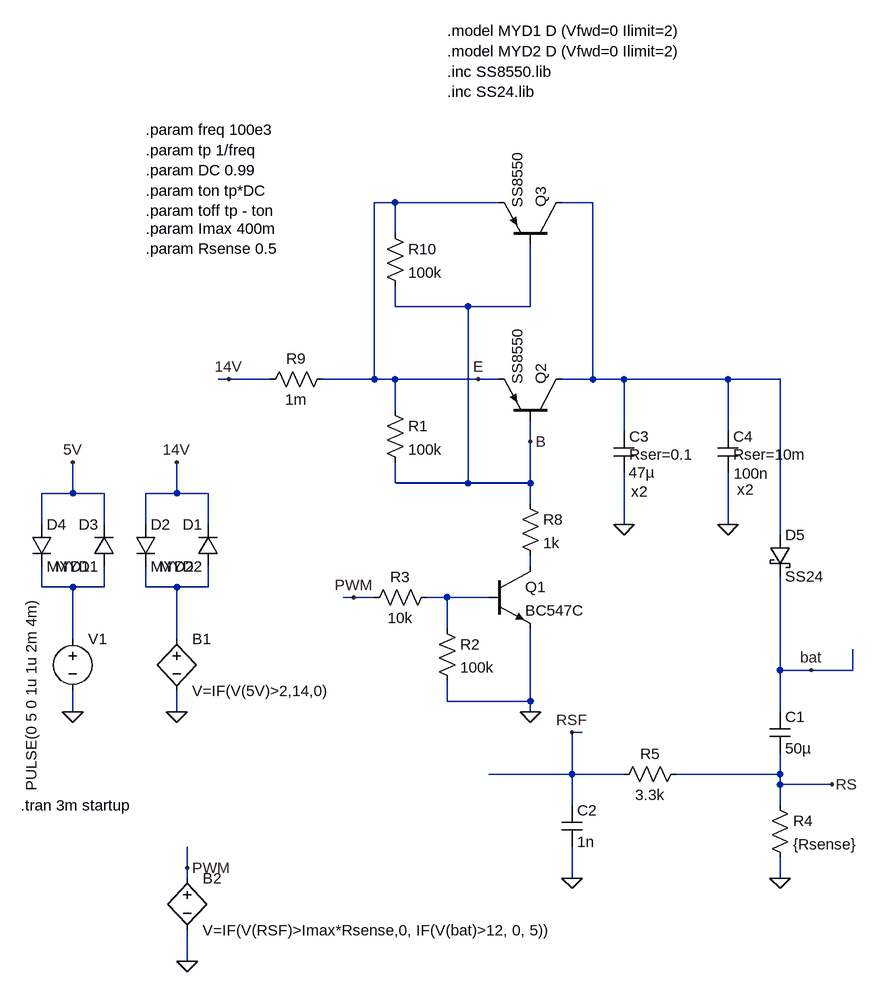
[diagram p0: schematic 01_nimh_version_1.asc]
01_nimh_version_1.asc, the LTspice schematic file:
Version 4
SHEET 1 1584 1388
WIRE 464 -528 432 -528
WIRE 624 -528 464 -528
WIRE 768 -528 720 -528
WIRE 464 -480 464 -528
WIRE 464 -368 464 -400
WIRE 576 -368 464 -368
WIRE 672 -368 672 -464
WIRE 672 -368 576 -368
WIRE 208 -256 192 -256
WIRE 272 -256 208 -256
WIRE 432 -256 432 -528
WIRE 432 -256 352 -256
WIRE 464 -256 432 -256
WIRE 592 -256 464 -256
WIRE 624 -256 592 -256
WIRE 768 -256 768 -528
WIRE 768 -256 720 -256
WIRE 816 -256 768 -256
WIRE 976 -256 816 -256
WIRE 1056 -256 976 -256
WIRE 464 -208 464 -256
WIRE 816 -176 816 -256
WIRE 976 -176 976 -256
WIRE 672 -160 672 -192
WIRE 464 -96 464 -128
WIRE 576 -96 576 -368
WIRE 576 -96 464 -96
WIRE 672 -96 672 -160
WIRE 672 -96 576 -96
WIRE -32 -80 -32 -128
WIRE -32 -80 -80 -80
WIRE 16 -80 -32 -80
WIRE 128 -80 128 -128
WIRE 128 -80 80 -80
WIRE 176 -80 128 -80
WIRE 672 -64 672 -96
WIRE -80 -32 -80 -80
WIRE 16 -32 16 -80
WIRE 80 -32 80 -80
WIRE 176 -32 176 -80
WIRE 816 -32 816 -112
WIRE 976 -32 976 -112
WIRE 1056 -16 1056 -256
WIRE 672 32 672 16
WIRE -80 64 -80 32
WIRE -32 64 -80 64
WIRE 16 64 16 32
WIRE 16 64 -32 64
WIRE 80 64 80 32
WIRE 128 64 80 64
WIRE 176 64 176 32
WIRE 176 64 128 64
WIRE 400 80 384 80
WIRE 432 80 400 80
WIRE 544 80 512 80
WIRE 608 80 544 80
WIRE 544 128 544 80
WIRE -32 144 -32 64
WIRE 128 144 128 64
WIRE 1056 192 1056 48
WIRE 1104 192 1056 192
WIRE 1168 192 1168 160
WIRE 1168 192 1104 192
WIRE 544 240 544 208
WIRE 672 240 672 128
WIRE 672 240 544 240
WIRE -32 256 -32 224
WIRE 128 256 128 224
WIRE 672 256 672 240
WIRE 1056 256 1056 192
WIRE 752 288 736 288
WIRE 736 352 736 288
WIRE 736 352 608 352
WIRE 816 352 736 352
WIRE 1056 352 1056 320
WIRE 1056 352 896 352
WIRE 1056 368 1056 352
WIRE 1136 368 1056 368
WIRE 736 400 736 352
WIRE 1056 400 1056 368
WIRE 144 496 144 464
WIRE 144 512 144 496
WIRE 736 512 736 464
WIRE 1056 512 1056 480
WIRE 144 640 144 592
FLAG -32 256 0
FLAG 128 256 0
FLAG 128 -128 14V
FLAG -32 -128 5V
FLAG 672 256 0
FLAG 208 -256 14V
FLAG 400 80 PWM
FLAG 1056 512 0
FLAG 736 512 0
FLAG 1136 368 RS
FLAG 736 288 RSF
FLAG 1104 192 bat
FLAG 144 640 0
FLAG 144 496 PWM
FLAG 672 -160 B
FLAG 816 -32 0
FLAG 976 -32 0
FLAG 592 -256 E
SYMBOL voltage -32 128 R0
WINDOW 3 -64 -47 VRight 2
WINDOW 123 0 0 Left 0
WINDOW 39 0 0 Left 0
SYMATTR Value PULSE(0 5 0 1u 1u 2m 4m)
SYMATTR InstName V1
SYMBOL bv 128 128 R0
SYMATTR InstName B1
SYMATTR Value V=IF(V(5V)>2,14,0)
SYMBOL diode 192 32 R180
WINDOW 0 24 64 Left 2
WINDOW 3 24 0 Left 2
SYMATTR InstName D1
SYMATTR Value MYD2
SYMBOL diode 64 -32 R0
SYMATTR InstName D2
SYMATTR Value MYD2
SYMBOL diode 32 32 R180
WINDOW 0 24 64 Left 2
WINDOW 3 24 0 Left 2
SYMATTR InstName D3
SYMATTR Value MYD1
SYMBOL diode -96 -32 R0
SYMATTR InstName D4
SYMATTR Value MYD1
SYMBOL res 448 -224 R0
SYMATTR InstName R1
SYMATTR Value 100k
SYMBOL npn 608 32 R0
SYMATTR InstName Q1
SYMATTR Value BC547C
SYMBOL res 528 112 R0
SYMATTR InstName R2
SYMATTR Value 100k
SYMBOL res 528 64 R90
WINDOW 0 0 56 VBottom 2
WINDOW 3 32 56 VTop 2
SYMATTR InstName R3
SYMATTR Value 10k
SYMBOL schottky 1040 -16 R0
SYMATTR InstName D5
SYMATTR Value SS24
SYMATTR Description Diode
SYMATTR Type diode
SYMBOL cap 1040 256 R0
SYMATTR InstName C1
SYMATTR Value 50µ
SYMBOL res 1040 384 R0
SYMATTR InstName R4
SYMATTR Value {Rsense}
SYMBOL res 912 336 R90
WINDOW 0 0 56 VBottom 2
WINDOW 3 32 56 VTop 2
SYMATTR InstName R5
SYMATTR Value 3.3k
SYMBOL cap 720 400 R0
SYMATTR InstName C2
SYMATTR Value 1n
SYMBOL bv 144 496 R0
SYMATTR InstName B2
SYMATTR Value V=IF(V(RSF)>Imax*Rsense,0, IF(V(bat)>12, 0, 5))
SYMBOL res 656 -80 R0
SYMATTR InstName R8
SYMATTR Value 1k
SYMBOL res 368 -272 R90
WINDOW 0 0 56 VBottom 2
WINDOW 3 32 56 VTop 2
SYMATTR InstName R9
SYMATTR Value 1m
SYMBOL cap 800 -176 R0
WINDOW 3 23 64 Left 2
WINDOW 39 24 36 Left 2
WINDOW 123 27 93 Left 2
SYMATTR InstName C3
SYMATTR Value 47µ
SYMATTR SpiceLine Rser=0.1
SYMATTR Value2 x2
SYMBOL pnp 720 -192 M270
SYMATTR InstName Q2
SYMATTR Value SS8550
SYMBOL cap 960 -176 R0
WINDOW 3 25 65 Left 2
WINDOW 39 24 36 Left 2
WINDOW 123 30 90 Left 2
SYMATTR InstName C4
SYMATTR Value 100n
SYMATTR SpiceLine Rser=10m
SYMATTR Value2 x2
SYMBOL res 448 -496 R0
SYMATTR InstName R10
SYMATTR Value 100k
SYMBOL pnp 720 -464 M270
SYMATTR InstName Q3
SYMATTR Value SS8550
TEXT -112 400 Left 2 !.tran 3m startup
TEXT 544 -792 Left 2 !.model MYD1 D (Vfwd=0 Ilimit=2)\n.model MYD2 D (Vfwd=0 Ilimit=2)\n.inc SS8550.lib\n.inc SS24.lib
TEXT 80 -488 Left 2 !.param Imax 400m\n.param Rsense 0.5
TEXT 80 -640 Left 2 !.param freq 100e3\n.param tp 1/freq\n.param DC 0.99\n.param ton tp*DC\n.param toff tp - ton

The netlist it stands for:
* 01_nimh_version_1.asc
V1 N003 0 PULSE(0 5 0 1u 1u 2m 4m)
B1 N004 0 V=IF(V(5V)>2,14,0)
D1 N004 14V MYD2
D2 14V N004 MYD2
D3 N003 5V MYD1
D4 5V N003 MYD1
R1 E B 100k
Q1 N002 N005 0 0 BC547C
R2 N005 0 100k
R3 N005 PWM 10k
D5 N001 bat SS24
C1 bat RS 50µ
R4 RS 0 {Rsense}
R5 RS RSF 3.3k
C2 RSF 0 1n
B2 PWM 0 V=IF(V(RSF)>Imax*Rsense,0, IF(V(bat)>12, 0, 5))
R8 B N002 1k
R9 E 14V 1m
C3 N001 0 47µ x2 Rser=0.1
Q2 N001 B E 0 SS8550
C4 N001 0 100n x2 Rser=10m
R10 E B 100k
Q3 N001 B E 0 SS8550
.model D D
.lib standard.dio
.model NPN NPN
.model PNP PNP
.lib standard.bjt
.tran 3m startup
.model MYD1 D (Vfwd=0 Ilimit=2)
.model MYD2 D (Vfwd=0 Ilimit=2)
.inc SS8550.lib
.inc SS24.lib
.param Imax 400m
.param Rsense 0.5
.param freq 100e3
.param tp 1/freq
.param DC 0.99
.param ton tp*DC
.param toff tp - ton
.backanno
.end